# EAGLE design oled (EAGLE 7.2.0)
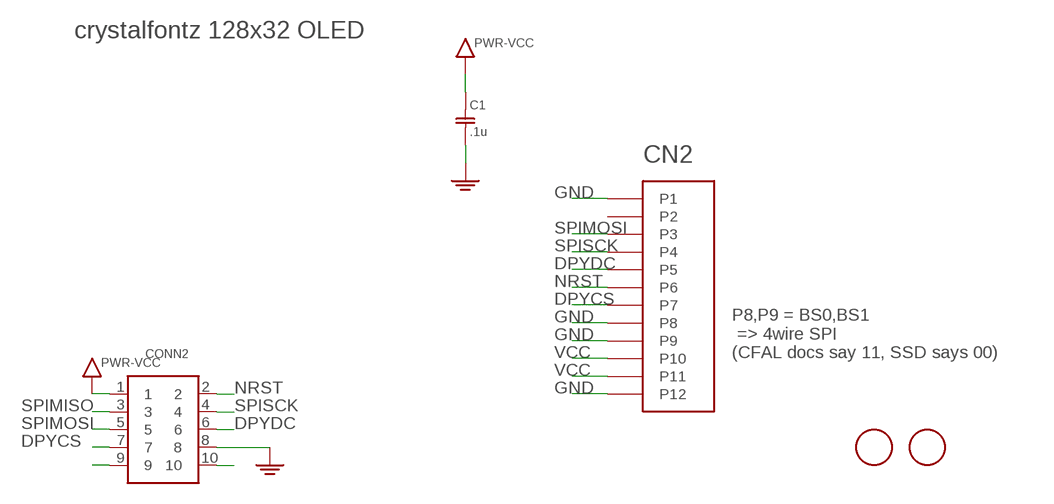
[diagram p0: schematic, sheet 1]

## Parts
C1  .1u  C0603  [SMD0603]
CN2  MA12-1  [M05-1X12-RA]
CONN2  HEADER-5X2-PTH  [HEADER-5X2-PTH]
U$1  FIDUCIAL  [FIDUCIAL_1MM]
U$2  FIDUCIAL  [FIDUCIAL_1MM]

## Nets
DPYCS: CN2.P7 CONN2.7
DPYDC: CN2.P5 CONN2.6
GND: C1.2 CN2.P1 CN2.P8 CN2.P9 CN2.P12 CONN2.8 ; supply symbol labelled PWR-GND
N$12: CONN2.9
N$19: CONN2.10
NRST: CN2.P6 CONN2.2
SPIMISO: CONN2.3
SPIMOSI: CN2.P3 CONN2.5
SPISCK: CN2.P4 CONN2.4
VCC: C1.1 CN2.P10 CN2.P11 CONN2.1 ; supply symbol labelled PWR-VCC
Unconnected: CN2.P2

## Notes on the sheet
- crystalfontz 128x32 OLED
- P8,P9 = BS0,BS1
   => 4wire SPI
  (CFAL docs say 11, SSD says 00)

## Library data of the parts
C1 = jaw:C
CN2 = jaw:MA12-1
CONN2 = jaw:HEADER-5X2
U$1 U$2 = adafruit:FIDUCIAL: For use by pick and place machines to calibrate the vision/machine, 1mm By microbuilder.eu

## Board
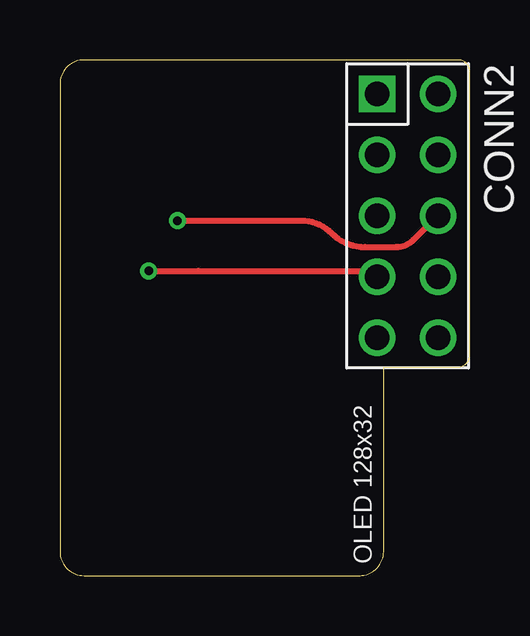
[diagram p1: board, top side]
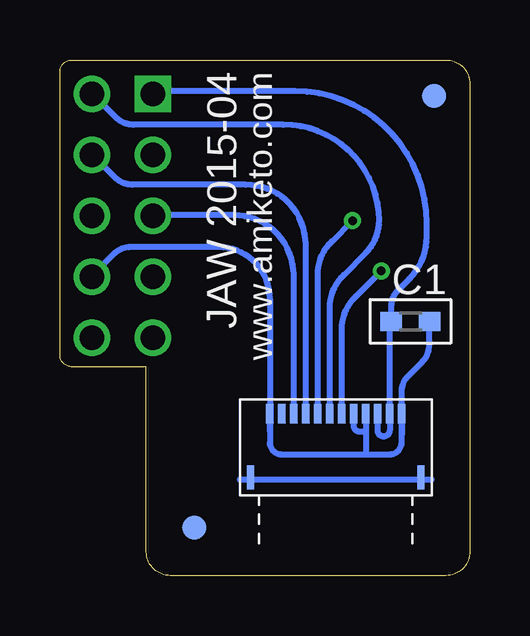
[diagram p2: board, bottom side, seen from below]

Size 17.1 x 21.5 mm. Coordinates in mm from the lower left corner, seen from the top.
Outline: 1,0 12.5,0 arc90 13.5,1 13.5,8.7 16.6,8.7 arc90 17.1,9.2 17.1,21 arc90 16.6,21.5 1,21.5 arc90 0,20.5 0,1 arc90 1,0
Copper layers (1*16): Top 0.0356mm / dielectric 1.5011mm / Bottom 0.0356mm
Design rules "LaenPCBOrder *": minimum track width 6mil, minimum drill 13mil, track to track 6mil, track to pad 6mil, pad to pad 6mil, via to via 6mil, smd to smd 6mil, copper to edge 15mil, drill to drill 6mil, minimum pad ring 10mil, minimum via ring 7mil, stop-mask expansion 4mil, vias tented up to drill 0.35mm, thermal gap 10mil

### Footprints (pad centres in the part's own frame; a part is rotated, then mirrored left to right if it is on the bottom)
SMD0603 = smd 0.9 x 0.8: 1 -0.8,0; 2 0.8,0
M05-1X12-RA = smd 0.3 x 0.8: P1 -2.75,0.4; P2 -2.25,0.4; P3 -1.75,0.4; P4 -1.25,0.4; P5 -0.75,0.4; P6 -0.25,0.4; P7 0.25,0.4; P8 0.75,0.4; P9 1.25,0.4; P10 1.75,0.4; P11 2.25,0.4; P12 2.75,0.4 | smd 0.3 x 1: P$13 3.55,-2.25; P$14 -3.55,-2.25
HEADER-5X2-PTH = drill 1.016 square: 1 -5.08,-1.27 | drill 1.016: 2 -5.08,1.27; 3 -2.54,-1.27; 4 -2.54,1.27; 5 0,-1.27; 6 0,1.27; 7 2.54,-1.27; 8 2.54,1.27; 9 5.08,-1.27; 10 5.08,1.27
FIDUCIAL_1MM = smd 1 x 1: 1 0,0

### Placement (x,y rotation side)
C1  2.48,10.6 0 bottom
CN2  5.6,6.35 0 bottom
CONN2  14.5,15 270 top
U$1  11.5,2 0 bottom
U$2  1.5,20 0 bottom

### Tracks (layer width: path | path; a pad name or v marks a point on that pad's centre or on a via)
DPYCS  (via drill 0.35)
  Top 0.25: v3.7,12.7 5.77,12.7 13.02,12.7 13.23,12.49 CONN2.7
  Bottom 0.25: CN2.P7 5.35,10.22 arc45 4.76,11.64 v3.7,12.7
DPYDC  (via drill 0.35)
  Top 0.25: v4.9,14.8 10.07,14.8 arc-45 11.31,14.29 arc45 12.73,13.7 14.03,13.7 arc45 14.73,13.99 15.74,15 CONN2.6
  Bottom 0.25: CN2.P5 6.35,12.52 arc45 5.76,13.94 v4.9,14.8
GND
  Bottom 0.25: 4.35,6 4.6,6 arc90 4.85,6.25 CN2.P8 | CN2.P12 2.85,5.86 | 8.35,6.01 8.35,6.6 CN2.P1 8.35,6.8 | 8.35,6.8 8.35,11.56 arc-90 10.49,13.7 14.15,13.7 arc-45 14.85,13.41 15.77,12.49 CONN2.8 | CN2.P9 4.35,6 | 4.35,5.05 3.35,5.05 arc-90 2.85,5.55 CN2.P12 | CN2.P12 2.85,7.64 arc45 2.56,8.34 1.99,8.91 arc-45 1.7,9.61 1.7,10.58 C1.2 | 4.35,6 4.35,5.05 | 8.35,6.8 8.35,5.55 arc-90 7.85,5.05 4.35,5.05
N$1
  Bottom 0.25: 1.6,4 9.6,4
NRST
  Bottom 0.25: CN2.P6 5.85,11.12 arc45 5.26,12.54 4.34,13.46 arc-45 3.79,14.8 arc-90 7.79,18.8 14.05,18.8 arc45 14.75,19.09 15.74,20.08 CONN2.2
SPIMOSI
  Bottom 0.25: CN2.P3 7.35,12.53 arc-90 9.85,15.03 13.2,15.03 CONN2.5
SPISCK
  Bottom 0.25: CN2.P4 6.85,13.8 arc-90 9.35,16.3 14.09,16.3 arc45 14.79,16.59 15.74,17.54 CONN2.4
VCC
  Bottom 0.25: CN2.P10 3.85,6.05 arc-90 3.6,5.8 arc-90 3.35,6.05 CN2.P11 3.35,8.24 3.35,10.6 C1.1 3.28,11.21 arc45 2.99,11.91 2.53,12.37 arc-45 1.8,14.14 1.8,14.7 arc-90 7.3,20.2 13.14,20.2 13.23,20.11 CONN2.1

### Text on the board
tPlace: OLED 128x32
bPlace: www.amiketo.com | JAW 2015-04